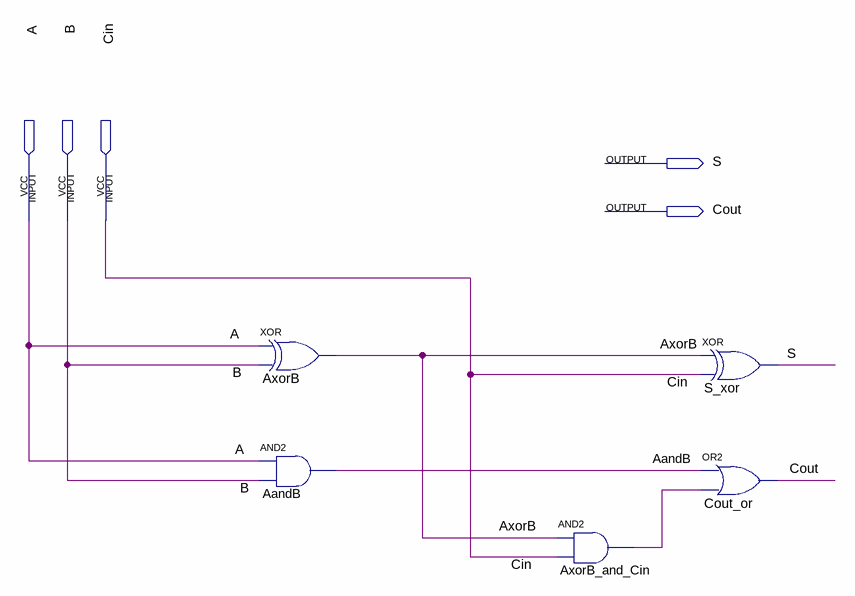
[diagram p0: schematic sheet]
// Quartus schematic FA.bdf as structural Verilog: 5 symbols, 5 pins
module FA (
  input  A,
  input  B,
  input  Cin,
  output S,
  output Cout
);

  wire AandB, AxorB, AxorB_and_Cin_out;

  xor u_AxorB (AxorB, A, B);
  and u_AandB (AandB, A, B);
  and AxorB_and_Cin (AxorB_and_Cin_out, AxorB, Cin);
  xor S_xor (S, AxorB, Cin);
  or Cout_or (Cout, AandB, AxorB_and_Cin_out);
endmodule
